# EAGLE design board (EAGLE 6.3)
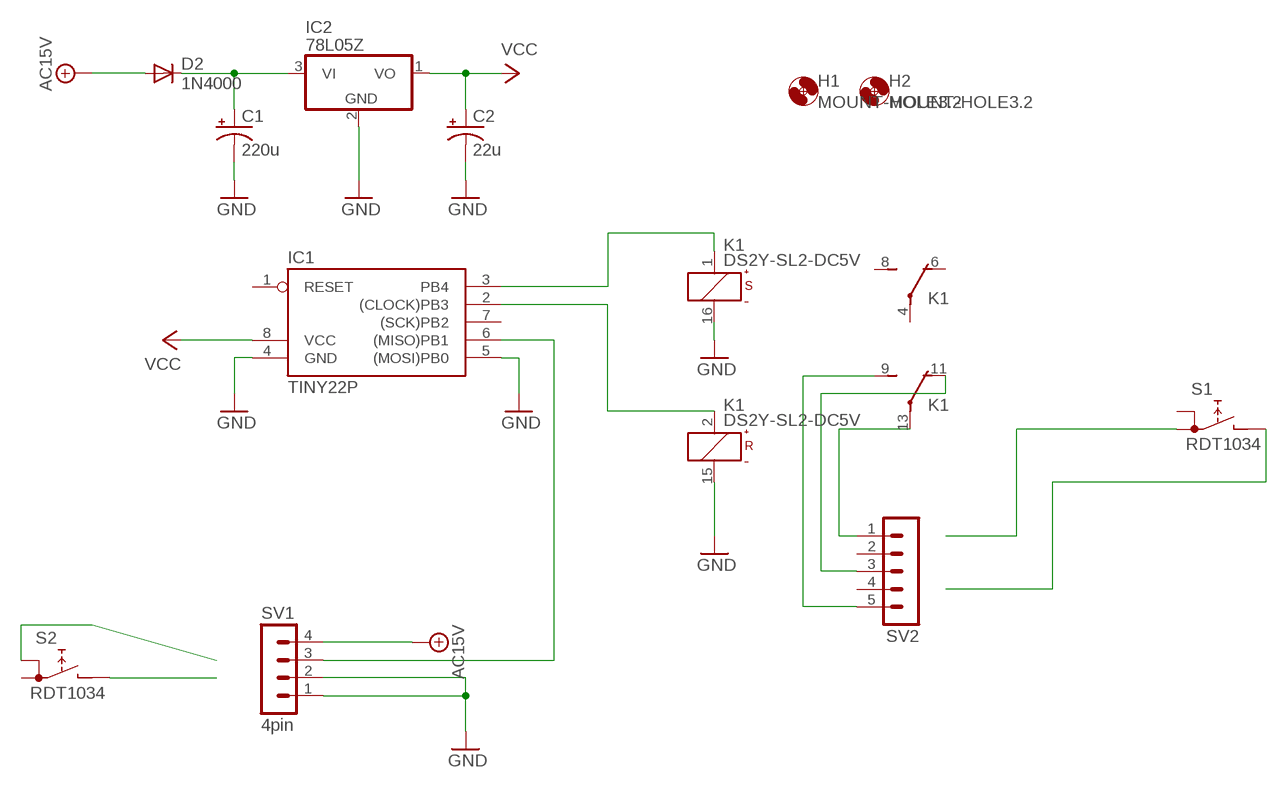
[diagram p0: schematic, sheet 1]

## Parts
C1  220u  CPOL-USE5-10.5  [E5-10,5]
C2  22u  CPOL-USE5-10.5  [E5-10,5]
D2  1N4000  DIODE-D-12.5  [D-12.5]
H1  MOUNT-HOLE3.2  [3,2]
H2  MOUNT-HOLE3.2  [3,2]
IC1  TINY22P  [DIL08]
IC2  78L05Z  [TO92]
K1  DS2Y-SL2-DC5V  [DS2Y-2]
S1  RDT1034  [RDT1034]
S2  RDT1034  [RDT1034]
SV1  4pin  MA04-1  [MA04-1]
SV2  MA05-1  [MA05-1]

## Nets
+15V: D2.A SV1.4 ; supply symbol labelled AC15V
GND: C1.- C2.- IC1.4(GND) IC1.5((MOSI)PB0) IC2.2(GND) K1.15(R:-) K1.16(S:-) SV1.1 SV1.2
N$1: IC1.3(PB4) K1.1(S:+)
N$2: S1.A1
N$3: IC1.2((CLOCK)PB3) K1.2(R:+)
N$4: K1.13(2:P) SV2.1
N$5: K1.9(2:S) SV2.5
N$6: K1.11(2:O) SV2.3
N$7: C1.+ D2.C IC2.3(VI)
N$8: S2.B
N$10: IC1.6((MISO)PB1) SV1.3
N$11: S1.B
N$12: S2.A
VCC: C2.+ IC1.8(VCC) IC2.1(VO)
Unconnected: IC1.1(RESET) IC1.7((SCK)PB2) K1.4(1:P) K1.6(1:O) K1.8(1:S) S1.A S2.A1 SV2.2 SV2.4

## Library data of the parts
C1 C2 = rcl:CPOL-US: POLARIZED CAPACITOR, American symbol
D2 = diode:DIODE-: DIODE
H1 H2 = holes:MOUNT-HOLE: MOUNTING HOLE with drill center marker
IC1 = atmel:TINY22: MICROCONTROLLER 1K ROM 128 bytes RAM 128 bytes EEPROM; OC_FARNELL: unknown; OC_NEWARK: unknown
IC2 = linear:78*: Positive VOLTAGE REGULATOR Source: http://cache.national.com/ds/LM/LM78L05.pdf http://www.fairchildsemi.com/ds/LM/LM7805.pdf
K1 = relay:DS2Y-SL2-DC*: MINIATURE RELAY NAiS Source: http://www.mew-europe.com/.. en_ds_61005_0023.pdf; MF: AROMAT/ MATSUSHITA; MPN: DS2Y-SL2-DC5V; OC_FARNELL: unknown; OC_NEWARK: 93F4484
S1 S2 = switch:RDT1034: PUSH SWITCH www.radiohm.com
SV1 = con-lstb:MA04-1: PIN HEADER; OC_FARNELL: unknown; OC_NEWARK: unknown
SV2 = con-lstb:MA05-1: PIN HEADER; OC_FARNELL: unknown; OC_NEWARK: unknown

## Board
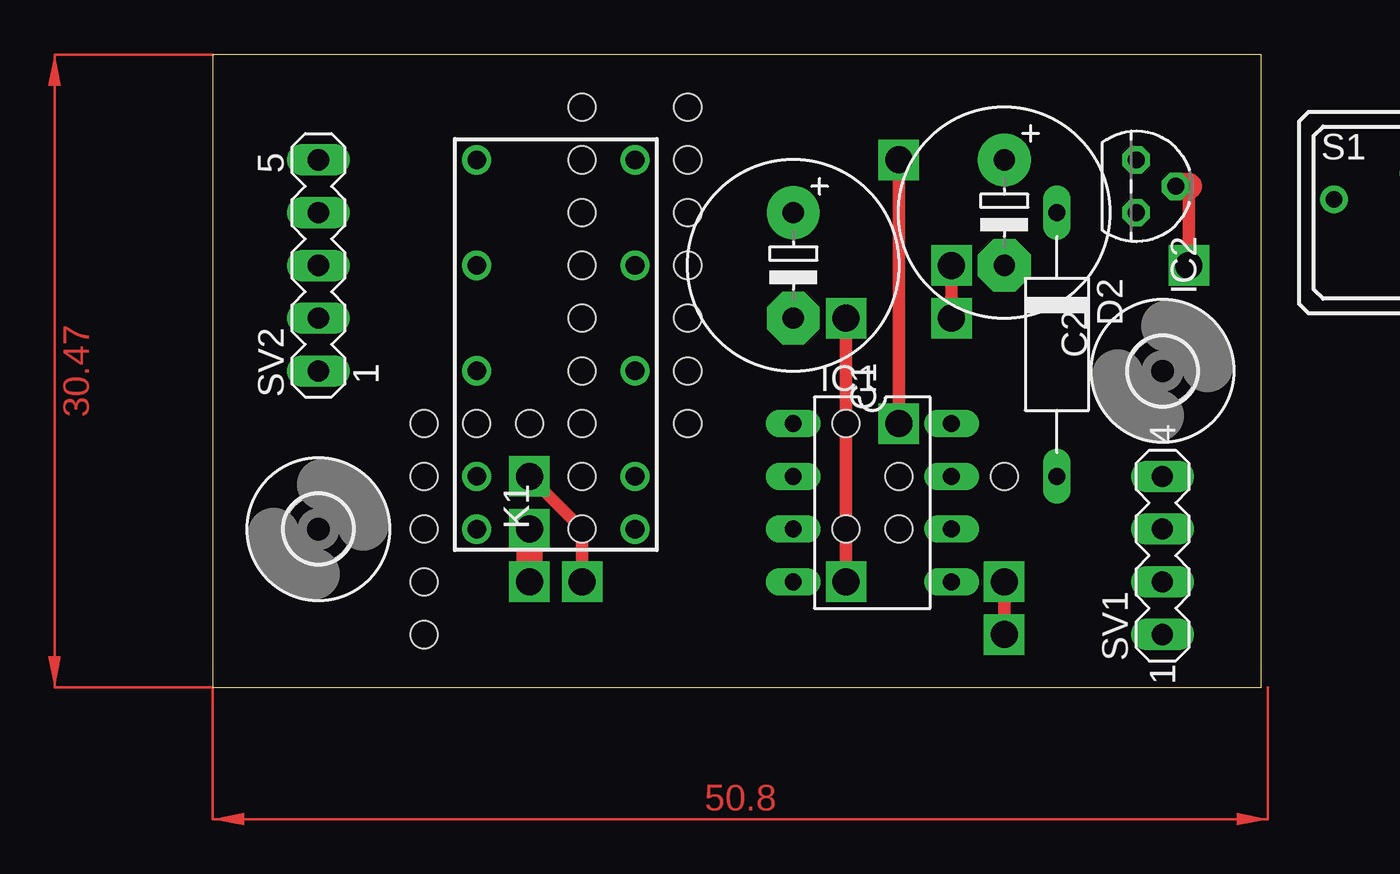
[diagram p1: board, top side]
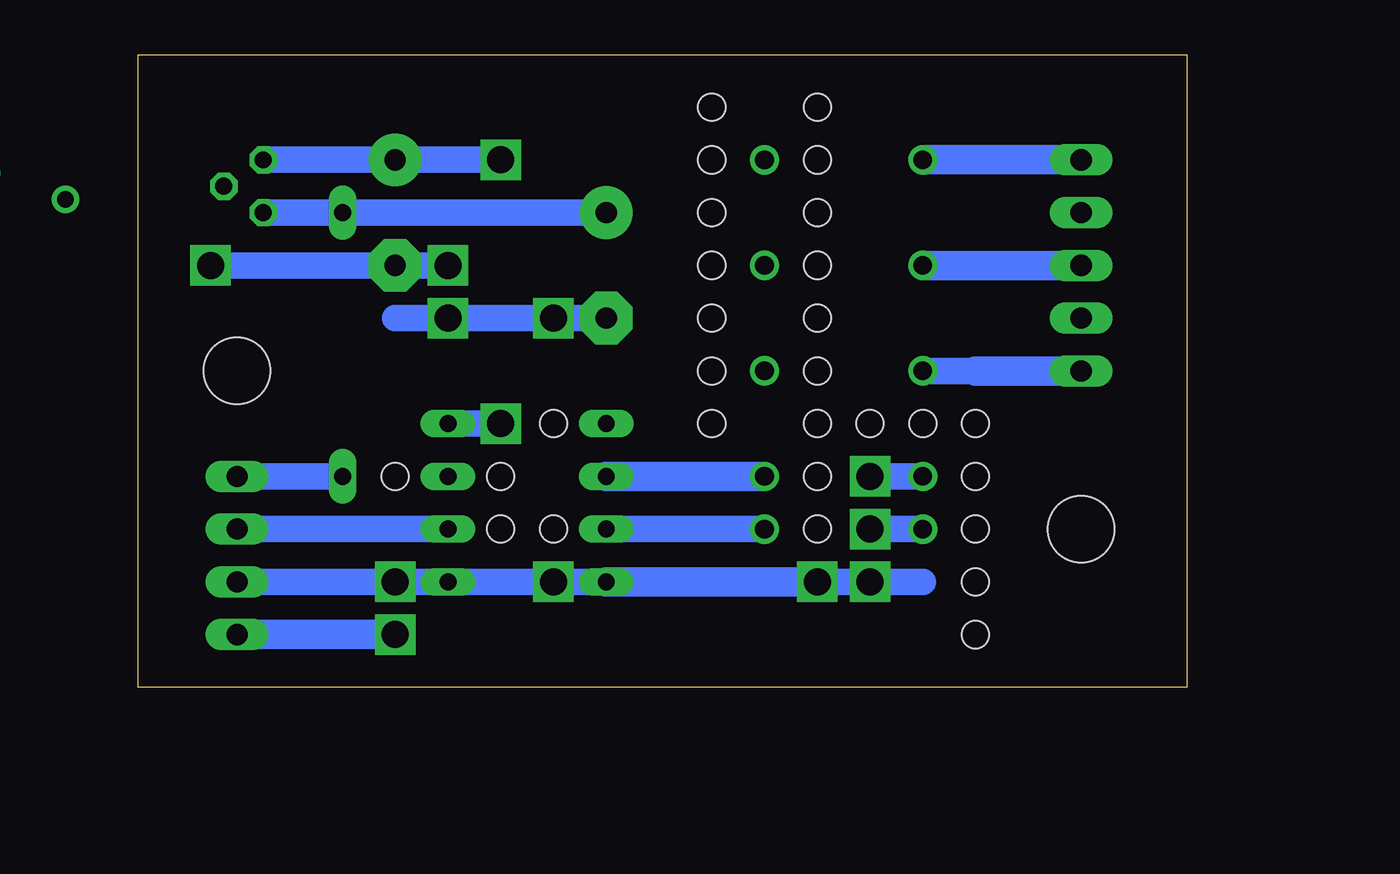
[diagram p2: board, bottom side, seen from below]

Size 50.47 x 30.47 mm. Coordinates in mm from the lower left corner, seen from the top.
Outline: 0,0 50.47,0 50.47,30.47 0,30.47 0,0
Copper layers (1*16): Top 0.035mm / dielectric 1.5mm / Bottom 0.035mm
Design rules "default *": minimum track width 10mil, minimum drill 24mil, track to track 8mil, track to pad 8mil, pad to pad 8mil, via to via 8mil, smd to smd 8mil, copper to edge 5mil, drill to drill 8mil, minimum pad ring 10mil, minimum via ring 8mil, stop-mask expansion 4mil, vias tented up to drill 0mil, thermal gap 10mil
Holes 1.3 mm at 22.86,12.7 33.02,7.62 30.48,7.62 33.02,10.16 30.48,12.7 38.1,10.16 17.78,7.62 17.78,10.16 17.78,12.7 17.78,15.24 17.78,17.78 17.78,20.32 17.78,22.86 17.78,25.4 17.78,27.94 15.24,12.7 12.7,12.7 10.16,12.7 10.16,10.16 10.16,5.08 10.16,7.62 22.86,15.24 22.86,17.78 22.86,20.32 22.86,22.86 22.86,25.4 22.86,27.94 10.16,2.54

### Footprints (pad centres in the part's own frame; a part is rotated, then mirrored left to right if it is on the bottom)
E5-10,5 = drill 1.016 pad 2.54: + -2.54,0 | drill 1.016 pad 2.54 octagon: - 2.54,0
D-12.5 = drill 0.813 long: A 6.35,0; C -6.35,0
3,2 = hole 3.2: 0,0
DIL08 = drill 0.813 long: 1 -3.81,-3.81; 2 -1.27,-3.81; 3 1.27,-3.81; 4 3.81,-3.81; 5 3.81,3.81; 6 1.27,3.81; 7 -1.27,3.81; 8 -3.81,3.81
TO92 = drill 0.813 octagon: 1 -1.27,0; 2 0,1.905; 3 1.27,0
DS2Y-2 = drill 0.9: 1 -8.89,-3.81; 2 -6.35,-3.81; 4 -1.27,-3.81; 6 3.81,-3.81; 8 8.89,-3.81; 9 8.89,3.81; 11 3.81,3.81; 13 -1.27,3.81; 15 -6.35,3.81; 16 -8.89,3.81
RDT1034 = drill 0.8: A 3.175,-0.635; A1 -3.175,0.635; B 0.65,1.9
MA04-1 = drill 1.016 long: 1 -3.81,0; 2 -1.27,0; 3 1.27,0; 4 3.81,0
MA05-1 = drill 1.016 long: 1 -5.08,0; 2 -2.54,0; 3 0,0; 4 2.54,0; 5 5.08,0

### Placement (x,y rotation side)
C1  27.94,20.32 270 top
C2  38.1,22.86 270 top
D2  40.64,16.51 270 top
H1  5.08,7.62 0 top
H2  45.72,15.24 0 top
IC1  31.75,8.89 270 top
IC2  44.45,24.13 270 top
K1  16.51,16.51 90 top
S1  57.15,22.86 0 top  (outside the outline)
S2  67.31,26.67 0 top  (outside the outline)
SV1  45.72,6.35 90 top
SV2  5.08,20.32 90 top

### Tracks (layer width: path | path; a pad name or v marks a point on that pad's centre or on a via)
+15V
  Bottom 1.27: SV1.4 D2.A
GND  (via drill 1.3)
  Top 0.61: v30.48,17.78 v30.48,5.08 | v35.56,20.32 v35.56,17.78 | v15.24,10.16 17.78,7.62 v17.78,5.08 | 46.99,24.13 v46.99,20.32 | v38.1,2.54 v38.1,5.08
  Top 1.27: v15.24,7.62 v15.24,5.08 | IC2.2 46.99,24.13
  Bottom 1.27: 12.7,5.08 v15.24,5.08 v17.78,5.08 | SV1.2 v38.1,5.08 IC1.5 v30.48,5.08 IC1.4 | 38.1,17.78 v35.56,17.78 v30.48,17.78 C1.- | v35.56,20.32 C2.- v46.99,20.32 | K1.15 v15.24,10.16 | K1.16 v15.24,7.62
  Bottom 1.422: SV1.1 v38.1,2.54 | IC1.4 v17.78,5.08
N$1
  Bottom 1.27: K1.1 IC1.3
N$3
  Bottom 1.422: K1.2 IC1.2
N$4
  Bottom 1.27: 10.16,15.24 K1.13
  Bottom 1.422: 10.16,15.24 SV2.1
N$5
  Bottom 1.422: K1.9 SV2.5
N$6
  Bottom 1.422: SV2.3 K1.11
N$7
  Bottom 1.27: IC2.3 D2.C C1.+
N$10
  Bottom 1.27: SV1.3 IC1.6
VCC  (via drill 1.3)
  Top 0.61: v33.02,25.4 v33.02,12.7
  Bottom 1.27: v33.02,25.4 C2.+ IC2.1 | v33.02,12.7 IC1.8
(copper drawn outside any net)
  shapes: Top area x2